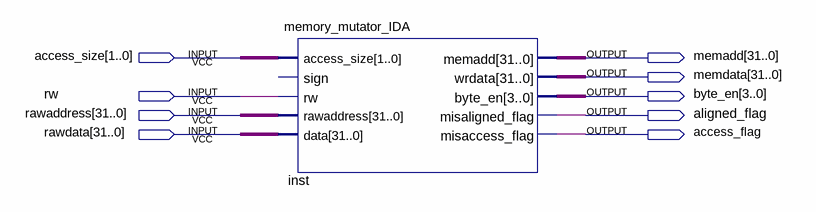
[diagram p0: schematic sheet]
// Quartus schematic IDA_test.bdf as structural Verilog: 1 symbols, 9 pins
module IDA_test (
  input  [1:0] access_size,
  input  rw,
  input  [31:0] rawaddress,
  input  [31:0] rawdata,
  output [31:0] memadd,
  output [31:0] memdata,
  output [3:0] byte_en,
  output aligned_flag,
  output access_flag
);

  memory_mutator_IDA inst (
    .access_size(access_size), .rw(rw), .rawaddress(rawaddress), .data(rawdata), .memadd(memadd),
    .wrdata(memdata), .byte_en(byte_en), .misaligned_flag(aligned_flag), .misaccess_flag(access_flag));  // open: sign
endmodule
